# EAGLE design Utility Shield 1.4 (EAGLE 7.7.0)
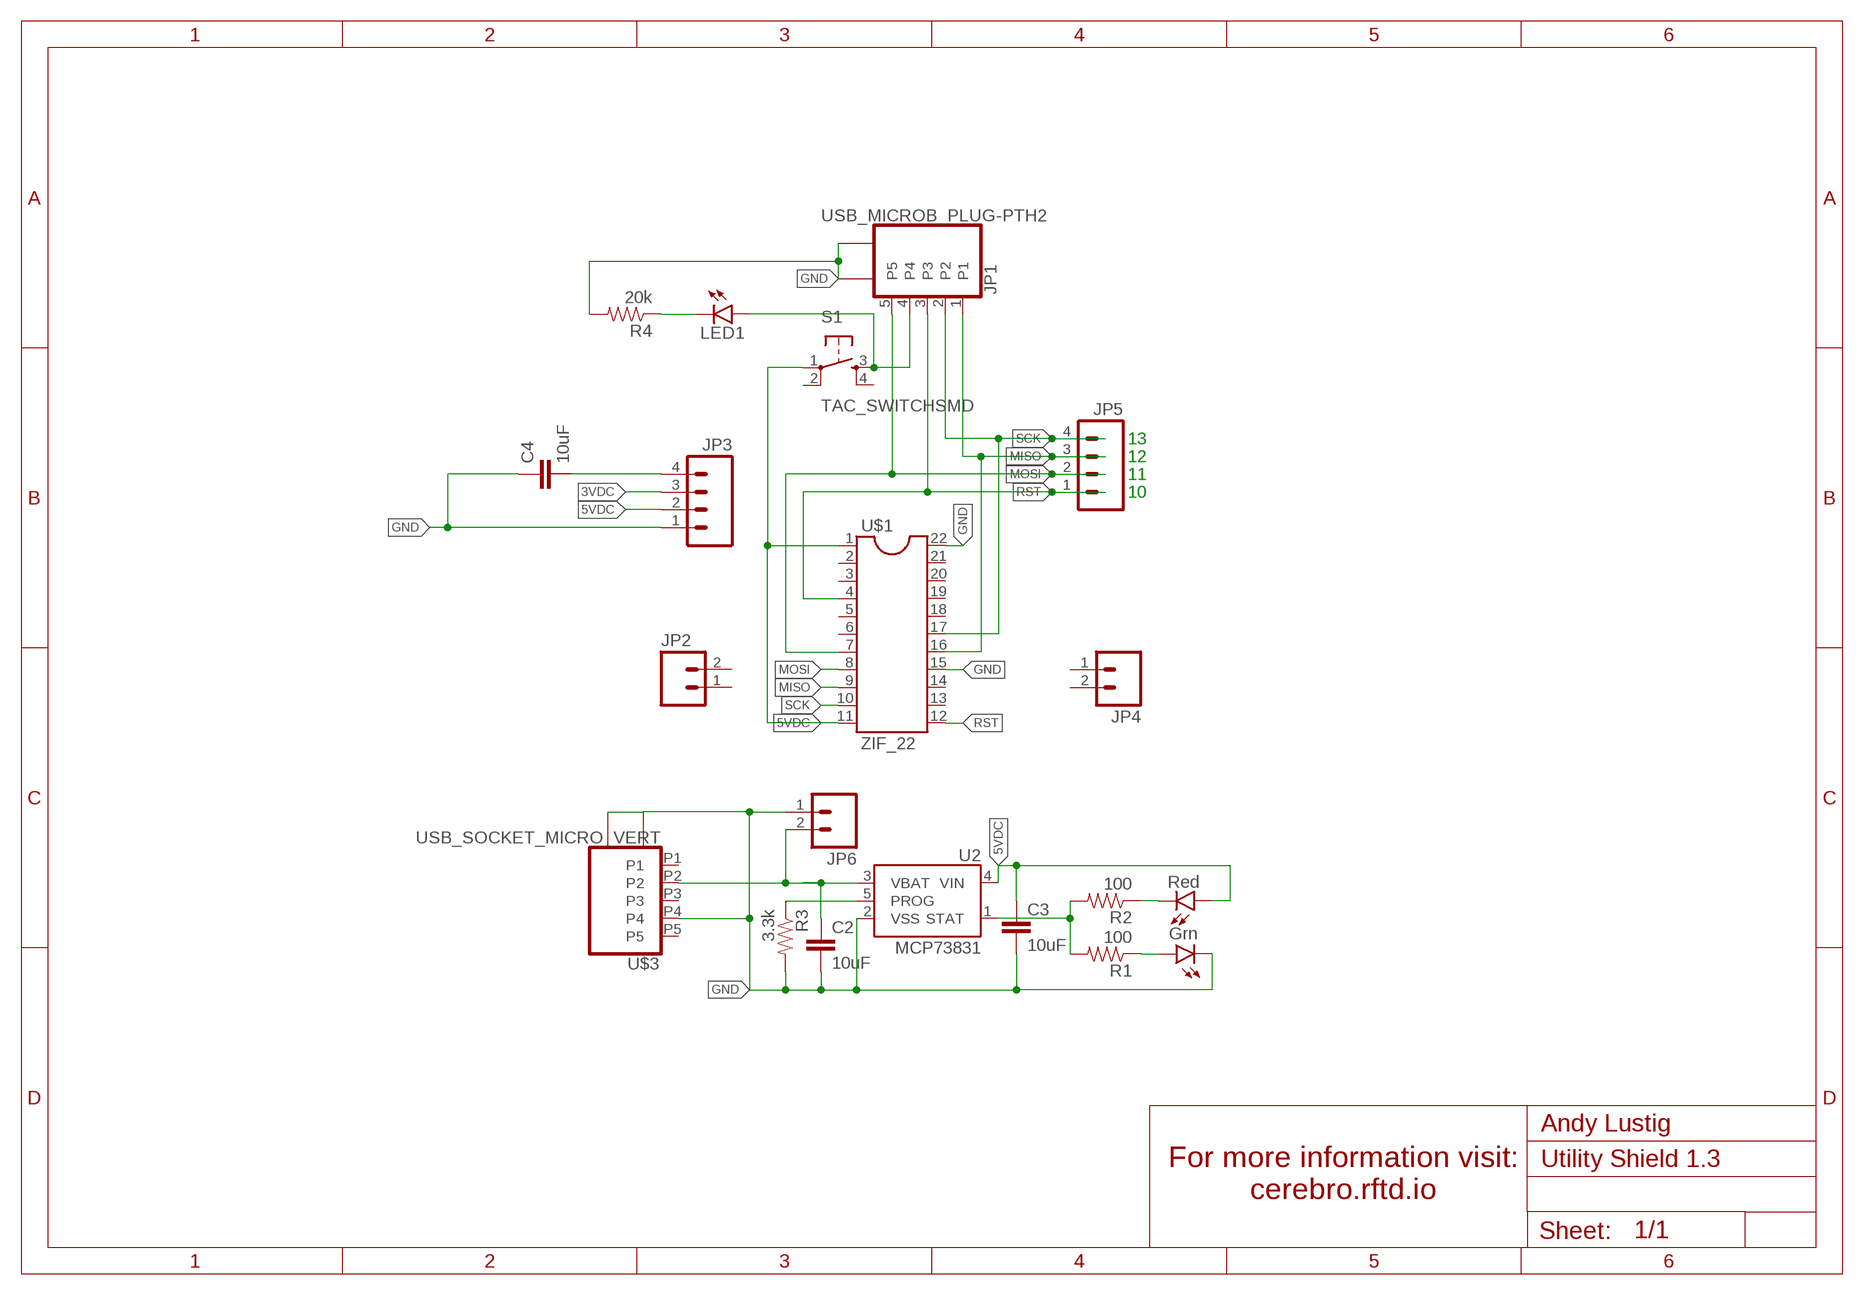
[diagram p0: schematic, sheet 1]

## Parts
C2  10uF  1.0UF-25V-+80/-20(0805)"  [0805-CAP]
C3  10uF  1.0UF-25V-+80/-20(0805)"  [0805-CAP]
C4  10uF  1.0UF-25V-+80/-20(0805)"  [0805-CAP]
JP1  USB_MICROB_PLUG-PTH2  [MICRO-B-TH]
JP2  M02PTH  [1X02]
JP3  M04PTH  [1X04]
JP4  M02PTH  [1X02]
JP5  M04PTH  [1X04]
JP6  M02-JST-2-PTH-NO_SILK  [JST-2-PTH-NS]
LED1  LED0603  [LED-0603]
R1  100  RESISTOR0805-RES  [0805]
R2  100  RESISTOR0805-RES  [0805]
R3  3.3k  RESISTOR0805-RES  [0805]
R4  20k  RESISTOR0805-RES  [0805]
S1  TAC_SWITCHSMD  [TACTILE-SWITCH-SMD]
U2  MCP73831  [SOT23-5]
U$1  ZIF_22  [ZIF_22]
U$2  LED_DUAL  [LED_DUAL]
U$3  USB_SOCKET_MICRO_VERT  [USB_VERT_MICRO_SMD]

## Nets
3VDC: JP3.3
5VDC: C3.1 JP3.2 S1.1 U2.4(VIN) U$1.1 U$1.11 U$2.RA
GND: C2.2 C3.2 C4.1 JP1.P$1 JP1.P$2 JP3.1 JP6.1 R3.2 R4.2 U2.2(VSS) U$1.15 U$1.22 U$2.GC U$3.P4 U$3.P$1 U$3.P$2 U$3.P$3
MISO: JP1.1 JP5.3 U$1.9 U$1.16
MOSI: JP1.5 JP5.2 U$1.7 U$1.8
N$1: C4.2 JP3.4
N$2: LED1.C R4.1
N$3: R1.2 R2.2 U2.1(STAT)
N$4: R1.1 U$2.GA
N$5: R2.1 U$2.RC
N$6: R3.1 U2.5(PROG)
N$7: JP1.4 LED1.A S1.3
N$9: C2.1 JP6.2 U2.3(VBAT) U$3.P2
RST: JP1.3 JP5.1 U$1.4 U$1.12
SCK: JP1.2 JP5.4 U$1.10 U$1.17
Unconnected: JP2.1 JP2.2 JP4.1 JP4.2 S1.2 S1.4 U$1.2 U$1.3 U$1.5 U$1.6 U$1.13 U$1.14 U$1.18 U$1.19 U$1.20 U$1.21 U$3.P1 U$3.P3 U$3.P5

## Notes on the sheet
- 13
- 12
- 11
- 10

## Library data of the parts
C2-C4 = SparkFun-Capacitors:1.0UF-25V-+80/-20(0805): CAP-11625; PROD_ID: CAP-11625; VALUE: 1.0uF
JP1 = Andy-library:USB_MICROB_PLUG: USB Micro-B connectors Some male, some female. Watch your step!
JP2 JP4 JP6 = SparkFun-Connectors:M02: Standard 2-pin 0.1" header. Use with - straight break away headers ( PRT-00116) - right angle break away headers (PRT-00553) - swiss pins (PRT-00743) - machine pins (PRT-00117) - female headers (PRT-00115) Molex polarized connector foot print use with: PRT-08233 with associated crimp pins and housings. 2.54_SCREWTERM for use with PRT-10571. 3.5mm Screw Terminal footprints for PRT-08084 5mm Screw Terminal footprints for use with PRT-08432
JP3 JP5 = SparkFun-Connectors:M04: Header 4 Standard 4-pin 0.1" header. Use with straight break away headers (SKU : PRT-00116), right angle break away headers (PRT-00553), swiss pins (PRT-00743), machine pins (PRT-00117), and female headers (PRT-00115). Molex polarized connector foot print use with SKU : PRT-08231 with associated crimp pins and housings. 1MM SMD Version SKU: PRT-10208
LED1 = Andy-library:LED: LEDs Standard schematic elements and footprints for 5mm, 3mm, 1206, and 0603 sized LEDs. 5mm - Spark Fun Electronics SKU : COM-00529 (and others)
R1-R4 = Andy-library:RESISTOR: Resistor Basic schematic elements and footprints for 0603, 1206, and PTH resistors.
S1 = Andy-library:TAC_SWITCH: Momentary Switch Button commonly used for reset or general input. Spark Fun Electronics SKU : COM-00097 SMT- SWCH-08247; PROD_ID: SWCH-08247
U2 = SparkFun-PowerIC:MCP73831: Miniature single cell, fully integrated Li-Ion, Li-polymer charge management controller http://ww1.microchip.com/downloads/en/DeviceDoc/20001984g.pdf IC-09995; PROD_ID: IC-09995
U$1 = Andy-library:ZIF_22
U$2 = Andy-library:LED_DUAL
U$3 = Andy-library:USB_SOCKET_MICRO_VERT: horizontal socket. Digikey 609-4616-1-ND

## Net classes
0 default: width 0.254 mm, clearance 0.254 mm
1 power: width 0.61 mm, drill 0.61 mm, clearance 0.254 mm
2 gnd: width 0.305 mm, drill 0.559 mm, clearance 0.254 mm
3 usbvcc: width 0.508 mm, drill 0.61 mm, clearance 0.254 mm
4 aref: width 0.406 mm, drill 0.61 mm, clearance 0.254 mm

## Board
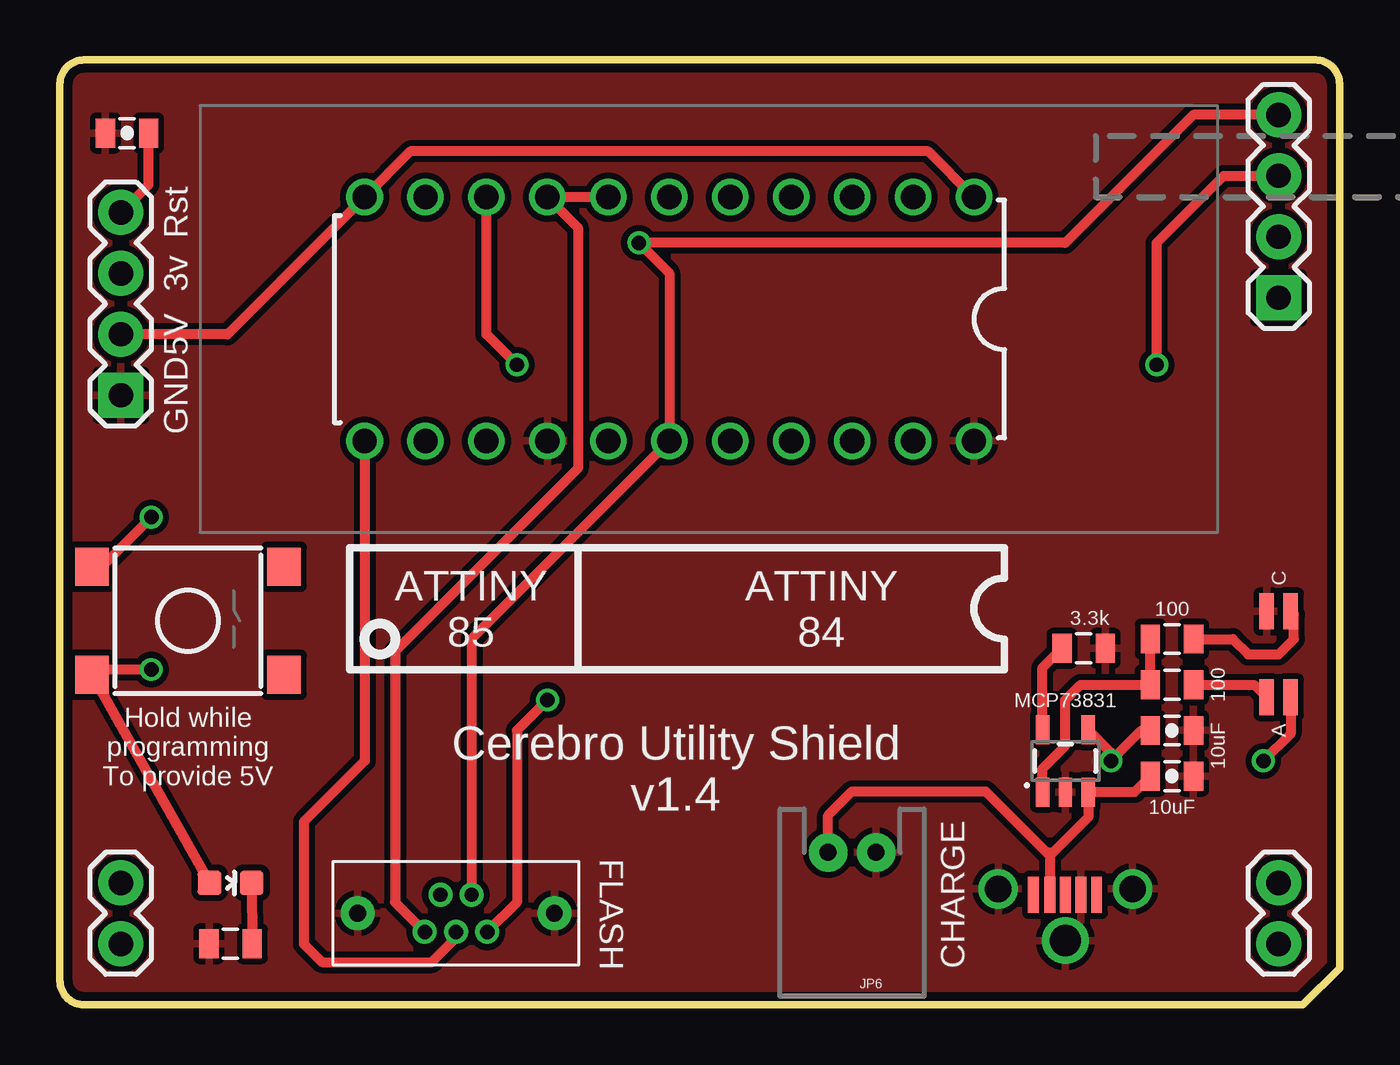
[diagram p1: board, top side]
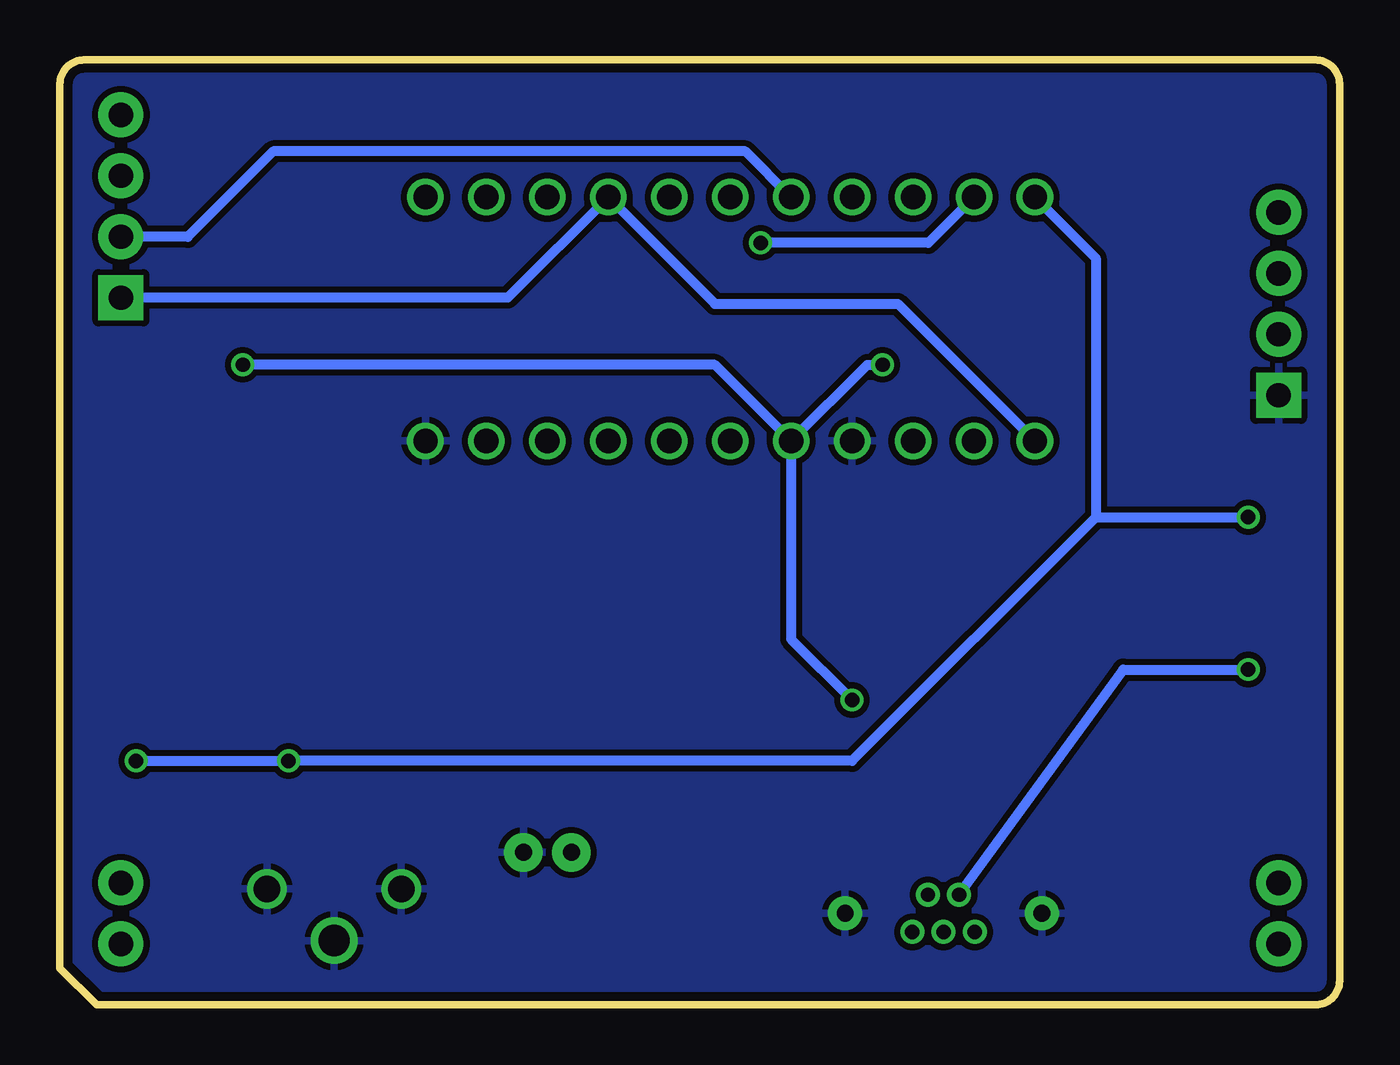
[diagram p2: board, bottom side, seen from below]

Size 53.34 x 39.37 mm. Coordinates in mm from the lower left corner, seen from the top.
Outline: 53.34,1.52 51.82,0 1,0 arc-90 0,1 0,38.37 arc-90 1,39.37 52.34,39.37 arc-90 53.34,38.37 53.34,1.52
Copper layers (1*16): Top 0.0356mm / dielectric 1.5011mm / Bottom 0.0356mm
Design rules "LaenPCBOrder": minimum track width 6mil, minimum drill 13mil, track to track 6mil, track to pad 6mil, pad to pad 6mil, via to via 6mil, smd to smd 6mil, copper to edge 15mil, drill to drill 6mil, minimum pad ring 7mil, minimum via ring 7mil, stop-mask expansion 3mil, vias tented up to drill 0mil, thermal gap 10mil

### Footprints (pad centres in the part's own frame; a part is rotated, then mirrored left to right if it is on the bottom)
0805-CAP = smd 0.8 x 1.2: 1 -0.9,0; 2 0.9,0
MICRO-B-TH = drill 0.6 pad 1: 1 -1.3,-0.775; 2 -0.65,0.775; 3 0,-0.775; 4 0.65,0.775; 5 1.3,-0.775 | drill 0.7 pad 1.422: P$1 -4.1,0; P$2 4.1,0
1X02 = drill 1.016 pad 1.88: 1 0,0; 2 2.54,0
1X04 = drill 1.016 pad 1.88 square: 1 0,0 | drill 1.016 pad 1.88: 2 2.54,0; 3 5.08,0; 4 7.62,0
JST-2-PTH-NS = drill 0.7 pad 1.6: 1 -1,0; 2 1,0
LED-0603 = smd 1 x 1: A 0,-0.877; C 0,0.877
0805 = smd 0.8 x 1.2: 1 -0.9,0; 2 0.9,0
TACTILE-SWITCH-SMD = smd 1.4 x 1.6: 1 -4,2.25; 2 4,2.25; 3 -4,-2.25; 4 4,-2.25
SOT23-5 = smd 0.55 x 1.2: 1 -0.95,-1.3; 2 0,-1.3; 3 0.95,-1.3; 4 0.95,1.3; 5 -0.95,1.3
ZIF_22 = drill 1.016: 1 -12.7,-5.08; 2 -10.16,-5.08; 3 -7.62,-5.08; 4 -5.08,-5.08; 5 -2.54,-5.08; 6 0,-5.08; 7 2.54,-5.08; 8 5.08,-5.08; 9 7.62,-5.08; 10 10.16,-5.08; 11 12.7,-5.08; 12 12.7,5.08; 13 10.16,5.08; 14 7.62,5.08; 15 5.08,5.08; 16 2.54,5.08; 17 0,5.08; 18 -2.54,5.08; 19 -5.08,5.08; 20 -7.62,5.08; 21 -10.16,5.08; 22 -12.7,5.08
LED_DUAL = smd 1.499 x 0.597: GA 1.791,-0.502; GC -1.791,-0.502; RA 1.791,0.502; RC -1.791,0.502
USB_VERT_MICRO_SMD = smd 0.45 x 1.5: P1 -1.33,-0.25; P2 -0.65,-0.25; P3 0,-0.25; P4 0.65,-0.25; P5 1.3,-0.25 | drill 1.1: P$1 -2.8,0; P$2 2.8,0 | drill 1.3: P$3 0,-2.15

### Placement (x,y rotation side)
C2  46.35,9.53 0 top
C3  46.35,11.43 0 top
C4  2.79,36.32 0 top
JP1  16.51,3.81 0 bottom
JP2  2.54,5.08 270 top
JP3  2.54,25.4 90 top
JP4  50.8,5.08 270 top
JP5  50.8,29.46 90 top
JP6  33.02,6.35 180 top
LED1  7.11,5.08 270 top
R1  46.35,13.34 180 top
R2  46.35,15.24 180 top
R3  42.67,14.86 0 top
R4  7.11,2.54 180 top
S1  5.33,16 0 top
U2  41.91,10.16 0 top
U$1  25.4,28.57 180 top
U$2  50.8,14.61 270 top
U$3  41.91,4.83 0 top

### Tracks (layer width: path | path; a pad name or v marks a point on that pad's centre or on a via)
5VDC  (via drill 0.6)
  Top 0.406: JP3.2 6.99,27.94 U$1.11 14.61,35.56 36.2,35.56 U$1.1 | U$2.RA 51.3,11.3 v50.16,10.16 | U2.4 43.81,10.51 v43.81,10.16 45.09,11.43 C3.1 | v3.81,20.32 1.74,18.25 S1.1
  Bottom 0.406: U$1.11 10.16,31.11 10.16,20.32 | 10.16,20.32 20.32,10.16 v43.81,10.16 v50.16,10.16 | 10.16,20.32 v3.81,20.32
GND
  pour Bottom: 54.61,41.91 54.61,-3.81 -1.27,-3.81 -1.27,41.91
  pour Top: 54.61,41.91 54.61,-3.81 -1.27,-3.81 -1.27,41.91
MISO  (via drill 0.6)
  Top 0.406: v19.05,26.67 17.78,27.94 U$1.9 | JP1.1 19.05,4.28 19.05,11.43 v20.32,12.7 | v45.72,26.67 45.72,31.75 48.51,34.54 JP5.3
  Bottom 0.406: U$1.16 19.68,26.67 v19.05,26.67 | U$1.16 22.86,15.24 v20.32,12.7 | U$1.16 26.04,26.67 v45.72,26.67
MOSI
  Top 0.406: U$1.7 U$1.8 21.59,32.38 21.59,22.35 13.97,14.73 13.97,4.28 JP1.5
  Bottom 0.406: U$1.7 24.77,35.56 44.45,35.56 48.01,32 JP5.2
N$1
  Top 0.406: JP3.4 3.69,34.17 C4.2
N$2
  Top 0.406: LED1.C R4.1
N$3
  Top 0.406: U2.1 40.96,9.85 41.91,10.79 41.91,12.7 42.55,13.34 R1.2 R2.2
N$4
  Top 0.406: R1.1 49.78,13.34 U$2.GA
N$5
  Top 0.406: R2.1 48.9,15.24 49.53,14.61 50.8,14.61 51.44,15.24 51.44,16.26 U$2.RC
N$6
  Top 0.406: U2.5 40.96,14.05 R3.1
N$7  (via drill 0.6)
  Top 0.406: v3.81,13.97 1.55,13.97 S1.3 LED1.A
  Bottom 0.406: JP1.4 9.02,13.97 v3.81,13.97
N$9
  Top 0.406: C2.1 44.79,8.86 U2.3 42.86,7.81 41.26,6.21 | 41.26,6.21 U$3.P2 | 41.26,6.35 41.26,6.21 | JP6.2 32.02,7.89 33.02,8.89 38.58,8.89 41.26,6.21
RST
  Top 0.406: JP1.3 16.51,2.79 15.49,1.78 10.92,1.78 10.16,2.54 10.16,7.62 12.7,10.16 U$1.12
  Bottom 0.406: U$1.12 18.41,29.21 26.04,29.21 U$1.4 34.67,29.46 JP5.1
SCK  (via drill 0.6)
  Top 0.406: JP5.4 47.24,37.08 41.91,31.75 v24.13,31.75 25.4,30.48 U$1.17 17.16,15.26 JP1.2
  Bottom 0.406: U$1.10 17.14,31.75 v24.13,31.75

### Text on the board
tPlace: ATTINY / 85
tNames: Rst | 3v | 5V | GND | ATTINY / 84 | Cerebro Utility Shield / v1.4 | Hold while / programming / To provide 5V | FLASH | CHARGE
214bmp: D:/SmartProjects/Snc/a4_bn_logo2.bmp